# EAGLE design USB Door Controller (EAGLE 5.11)
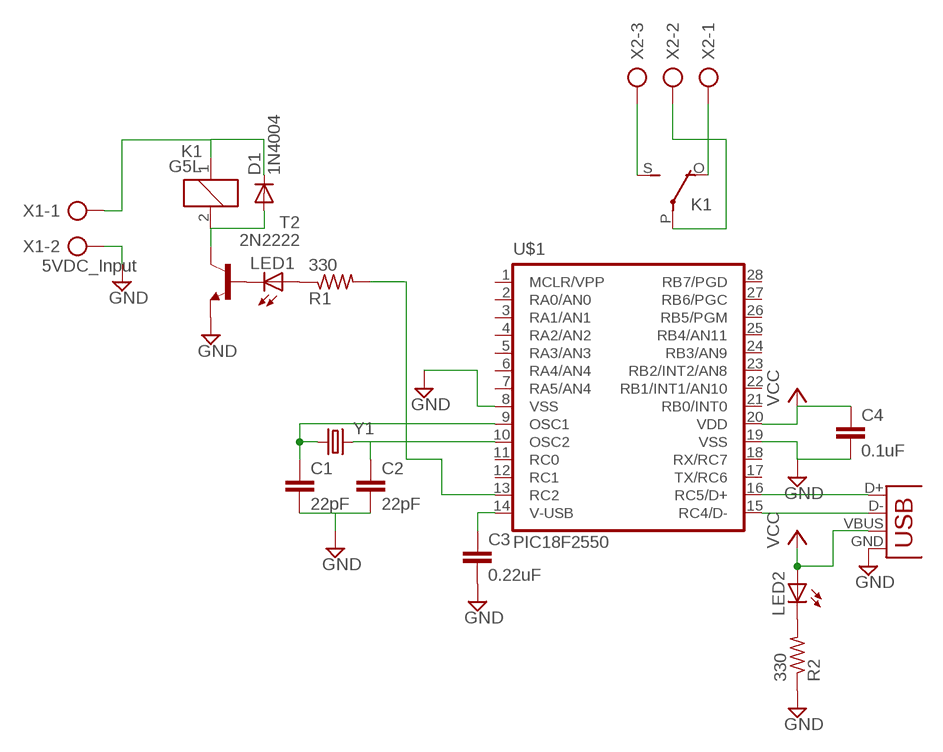
[diagram p0: schematic, sheet 1]

## Parts
C1  22pF  C5/3  [C5B3]
C2  22pF  C5/3  [C5B3]
C3  0.22uF  C5/3  [C5B3]
C4  0.1uF  C2,5-3  [C2.5-3]
D1  1N4004  [DO41-10]
K1  G5L  [G5LE]
LED1  LED3MM  [LED3MM]
LED2  LED3MM  [LED3MM]
R1  330  R-US_0204/7  [0204/7]
R2  330  R-US_0204/7  [0204/7]
T2  2N2222  [TO92-EBC-OVAL]
U$1  PIC18F2550  [DIL28-3]
X1  5VDC_Input  AK500/2-H  [AK500/2-H]
X2  AK500/3-H  [AK500/3-H]
X3  USBPTH  [USB-B-PTH]
Y1  CRYSTALHC49US  [HC49US]

## Nets
GND: C1.2 C2.2 C3.2 C4.2 R2.1 T2.E U$1.8(VSS) U$1.19(VSS) X1.2 X3.GND
N$1: D1.A K1.2 T2.C
N$2: LED1.K(C) T2.B
N$3: LED1.A R1.1
N$4: R1.2 U$1.13(RC2)
N$5: D1.C K1.1 X1.1
N$6: LED2.K(C) R2.2
N$7: C2.1 U$1.10(OSC2) Y1.2
N$8: C1.1 U$1.9(OSC1) Y1.1
N$11: C3.1 U$1.14(V-USB)
N$12: K1.O(2:O) X2.1
N$13: K1.S(2:S) X2.3
N$14: K1.P(2:P) X2.2
N$15: U$1.16(RC5/D+) X3.D+
N$16: U$1.15(RC4/D-) X3.D-
VCC: C4.1 LED2.A U$1.20(VDD) X3.VBUS
Unconnected: U$1.1(MCLR/VPP) U$1.2(RA0/AN0) U$1.3(RA1/AN1) U$1.4(RA2/AN2) U$1.5(RA3/AN3) U$1.6(RA4/AN4) U$1.7(RA5/AN4) U$1.11(RC0) U$1.12(RC1) U$1.17(TX/RC6) U$1.18(RX/RC7) U$1.21(RB0/INT0) U$1.22(RB1/INT1/AN10) U$1.23(RB2/INT2/AN8) U$1.24(RB3/AN9) U$1.25(RB4/AN11) U$1.26(RB5/PGM) U$1.27(RB6/PGC) U$1.28(RB7/PGD)

## Library data of the parts
C1-C4 = capacitor-wima:C: CAPACITOR naming: grid - package width
D1 = diode:1N4004: DIODE general purpose rectifier, 1 A
K1 = relay:G5L: RELAY 1 x switch, 10 A/120 V AC, 8 A/30 V ADC, Omron; OC_FARNELL: unknown; OC_NEWARK: unknown
LED1 LED2 = adafruit:LED: LED OSRAM: - CHIPLED LG R971, LG N971, LY N971, LG Q971, LY Q971, LO R971, LY R971 LH N974, LH R974 LS Q976, LO Q976, LY Q976 LO Q996 - Hyper CHIPLED LW Q18S LB Q993, LB Q99A, LB R99A - SideLED LS A670, LO A670, LY A670, LG A670, LP A670 LB A673, LV A673, LT A673, LW A673 LH A674 LY A675 LS A676, LA A676, LO A676, LY A676, LW A676 LS A679, LY A679, LG A679 - Hyper Micro SIDELED® LS Y876, LA Y876, LO Y876, LY Y876 LT Y87S - SmartLED LW L88C, LW L88S LB L89C, LB L89S, LG L890 LS L89K, LO L89K, LY L89K LS L896, LA L896, LO L896, LY L896 - TOPLED LS T670, LO T670, LY T670, LG T670, LP T670 LSG T670, LSP T670, LSY T670, LOP T670, LYG T670 LG T671, LOG T671, LSG T671 LB T673, LV T673, LT T673, LW T673 LH T674 LS T676, LA T676, LO T676, LY T676, LB T676, LH T676, LSB T676, LW T676 LB T67C, LV T67C, LT T67C, LS T67K, LO T67K, LY T67K, LW E67C LS E67B, LA E67B, LO E67B, LY E67B, LB E67C, LV E67C, LT E67C LW T67C LS T679, LY T679, LG T679 LS T770, LO T770, LY T770, LG T770, LP T770 LB T773, LV T773, LT T773, LW T773 LH T774 LS E675, LA E675, LY E675, LS T675 LS T776, LA T776, LO T776, LY T776, LB T776 LHGB T686 LT T68C, LB T68C - Hyper Mini TOPLED® LB M676 - Mini TOPLED Santana® LG M470 LS M47K, LO M47K, LY M47K Source: http://www.osram.convergy.de/
R1 R2 = adafruit:R-US_: RESISTOR, American symbol
T2 = adafruit:2N2222: NPN TRANSISTOR Big oval pads
U$1 = SparkFun:PIC18F2550
X1 = con-ptr500:AK500/2-H: CONNECTOR Aug. 2004 / PTR Meßtechnik: Die Bezeichnung der Serie AK505 wurde geändert. Es handelt sich hierbei um AK500 in horizontaler Ausführung.; OC_FARNELL: unknown; OC_NEWARK: unknown
X2 = con-ptr500:AK500/3-H: CONNECTOR Aug. 2004 / PTR Meßtechnik: Die Bezeichnung der Serie AK505 wurde geändert. Es handelt sich hierbei um AK500 in horizontaler Ausführung.; OC_FARNELL: unknown; OC_NEWARK: unknown
X3 = SparkFun:USB: USB Connectors USB-B-PTH is fully proven SKU : PRT-00139 USB-miniB is fully proven SKU : PRT-00587 USB-A-PCB is untested. USB-A-H is throughly reviewed, but untested. Spark Fun Electronics SKU : PRT-00437 USB-B-SMT is throughly reviewed, but untested. Needs silkscreen touching up. USB-A-S has not been used/tested USB-MB-H has not been used/tested
Y1 = SparkFun:CRYSTAL: Crystals Various standard crystals. Proven footprints. Spark Fun Electronics SKU : COM-00534

## Board
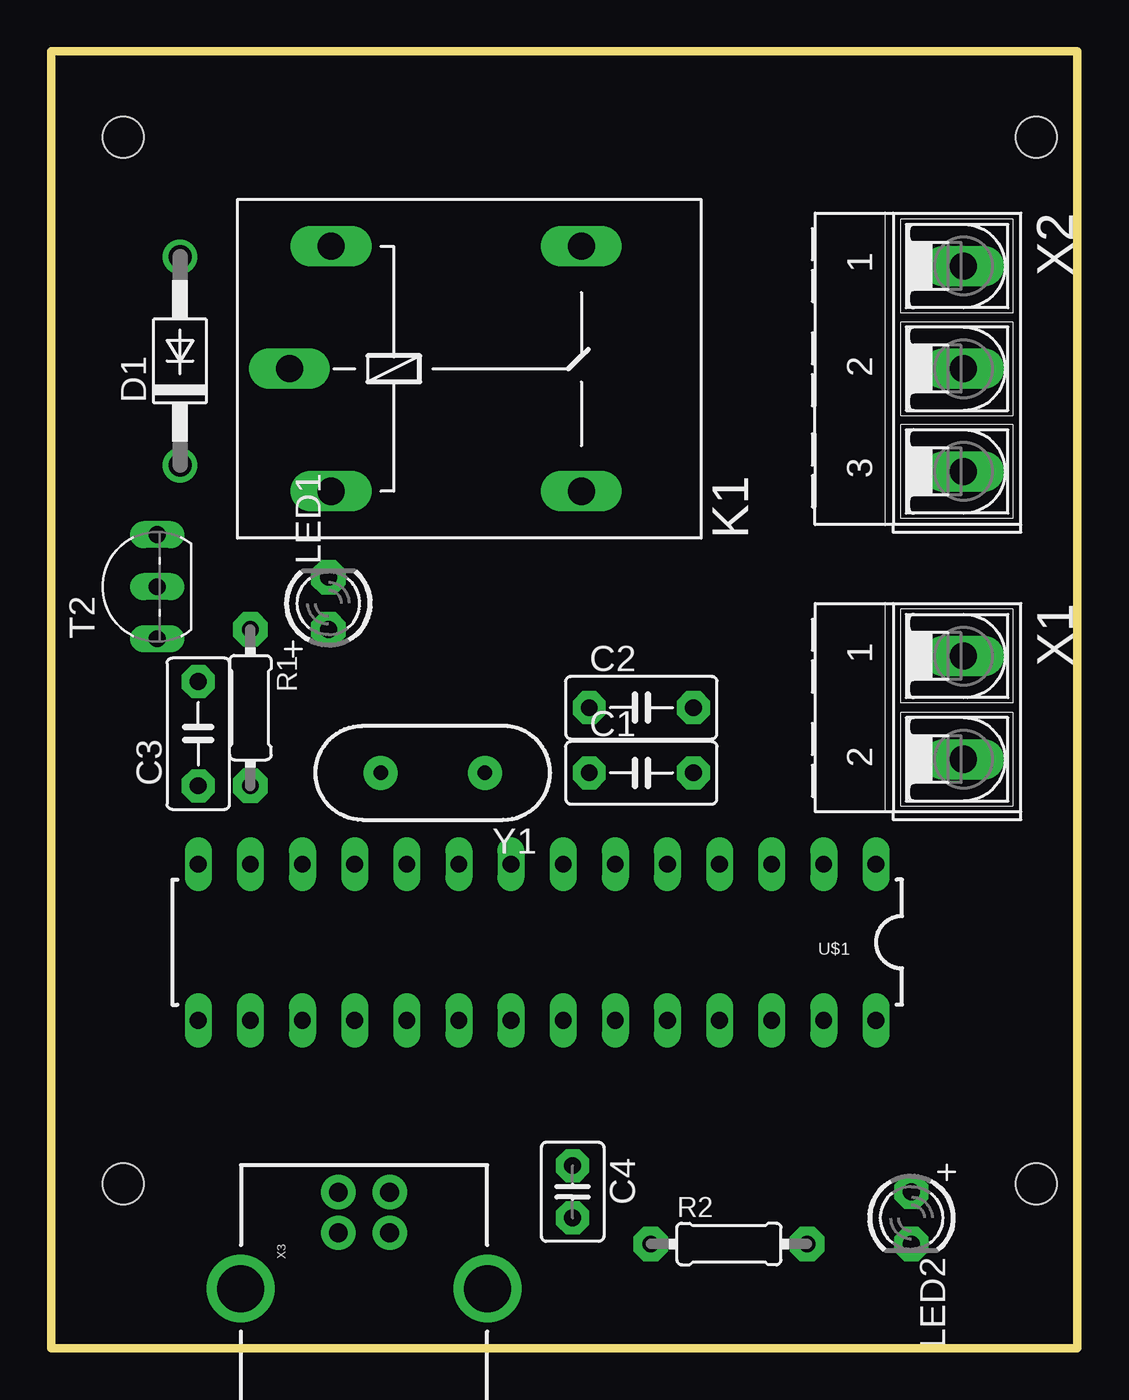
[diagram p1: board, top side]
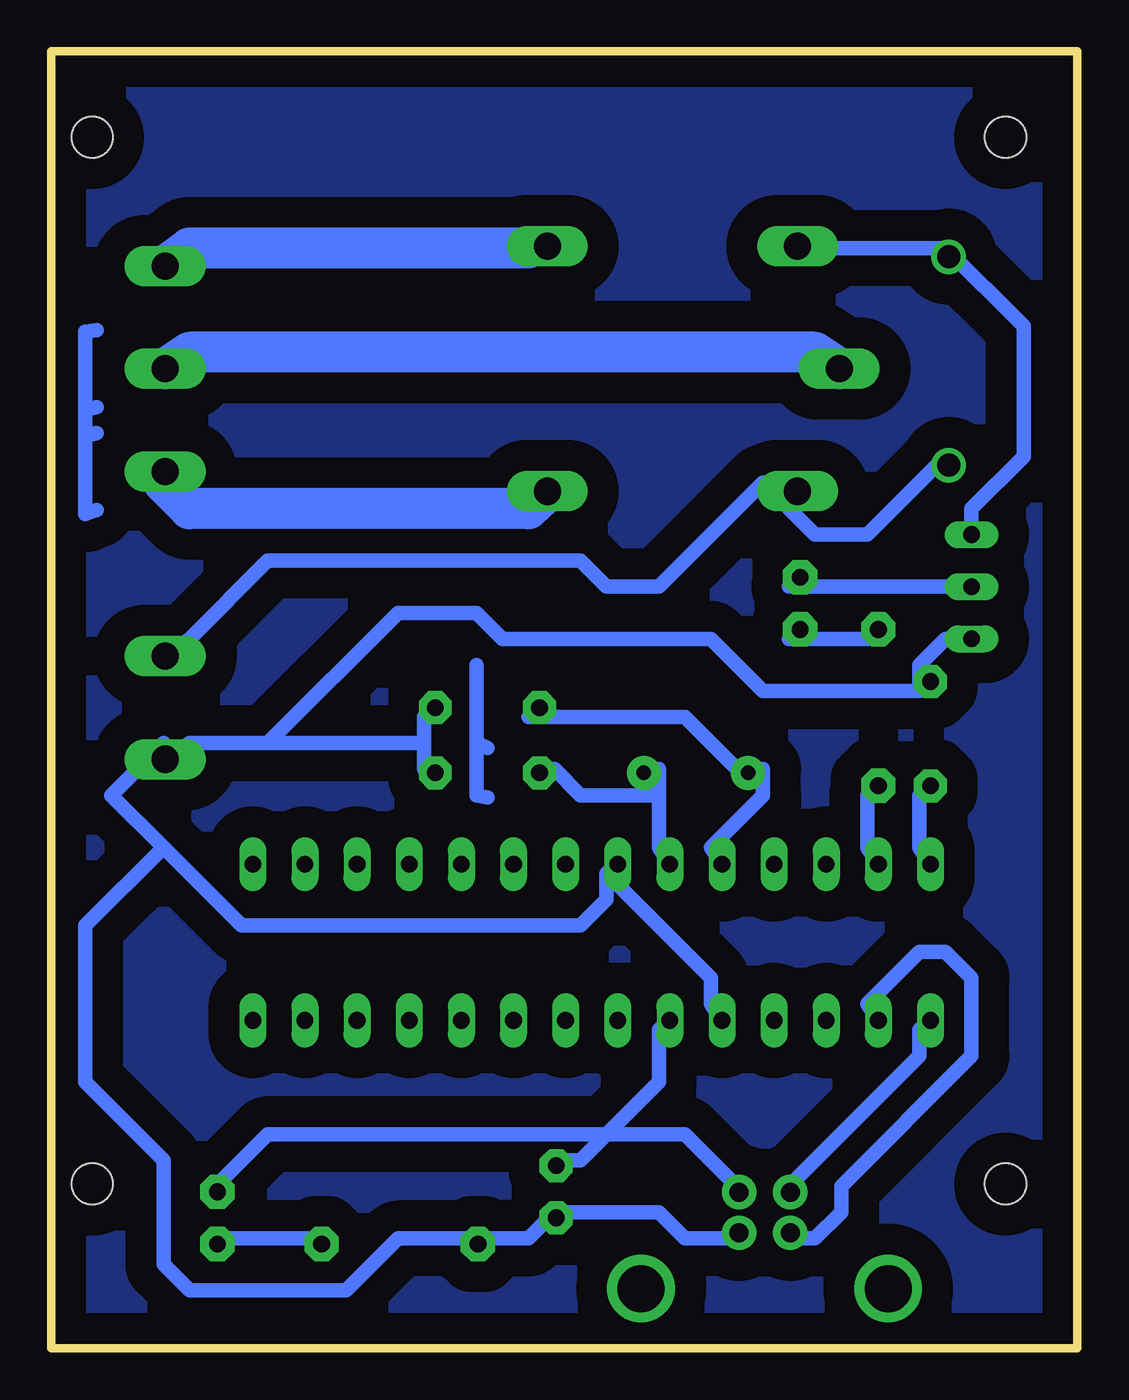
[diagram p2: board, bottom side, seen from below]

Size 50 x 63.19 mm. Coordinates in mm from the lower left corner, seen from the top.
Outline: 0,0 50,0 50,63.19 0,63.19 0,0
Copper layers (1*16): Top 0.035mm / dielectric 1.5mm / Bottom 0.035mm
Design rules "default *": minimum track width 0.7mm, minimum drill 0.6mm, track to track 0.7mm, track to pad 0.7mm, pad to pad 0.7mm, via to via 0.7mm, smd to smd 8mil, copper to edge 40mil, drill to drill 8mil, minimum pad ring 10mil, minimum via ring 8mil, stop-mask expansion 4mil, vias tented up to drill 0mil, thermal gap 10mil
Holes 2 mm at 3.5,8 48,8 48,59 3.5,59

### Footprints (pad centres in the part's own frame; a part is rotated, then mirrored left to right if it is on the bottom)
C5B3 = drill 0.813 pad 1.6 octagon: 1 -2.54,0; 2 2.54,0
C2.5-3 = drill 0.813 pad 1.6 octagon: 1 -1.27,0; 2 1.27,0
DO41-10 = drill 1.118 round: A 5.08,0; C -5.08,0
G5LE = drill 1.321 long: 1 -7.493,-5.969; 2 -7.493,5.969; O 4.699,5.969; P -9.525,0; S 4.699,-5.969
LED3MM = drill 0.813 pad 1.676 octagon: A -1.27,0; K 1.27,0
0204/7 = drill 0.813 pad 1.676 octagon: 1 -3.81,0; 2 3.81,0
TO92-EBC-OVAL = drill 0.813 long: B 0,-1.27; C 2.54,-1.27; E -2.54,-1.27
DIL28-3 = drill 0.813 long: 1 -16.51,-3.81; 2 -13.97,-3.81; 3 -11.43,-3.81; 4 -8.89,-3.81; 5 -6.35,-3.81; 6 -3.81,-3.81; 7 -1.27,-3.81; 8 1.27,-3.81; 9 3.81,-3.81; 10 6.35,-3.81; 11 8.89,-3.81; 12 11.43,-3.81; 13 13.97,-3.81; 14 16.51,-3.81; 15 16.51,3.81; 16 13.97,3.81; 17 11.43,3.81; 18 8.89,3.81; 19 6.35,3.81; 20 3.81,3.81; 21 1.27,3.81; 22 -1.27,3.81; 23 -3.81,3.81; 24 -6.35,3.81; 25 -8.89,3.81; 26 -11.43,3.81; 27 -13.97,3.81; 28 -16.51,3.81
AK500/2-H = drill 1.321 long: 1 -2.515,0; 2 2.515,0
AK500/3-H = drill 1.321 long: 1 -5.004,0; 2 0,0; 3 5.004,0
USB-B-PTH = drill 0.914 pad 1.676 round: D+ 0,1.25; D- 1.981,1.25; GND 0,-1.25; VBUS 1.981,-1.25 | drill 2.286 round: S1 -2.718,-6.02; S2 -2.718,6.02
HC49US = drill 0.7 pad 1.651 round: 1 -2.54,0; 2 2.54,0

### Placement (x,y rotation side)
C1  28.75,28.04 0 top
C2  28.75,31.21 0 top
C3  7.16,29.94 90 top
C4  25.4,7.62 270 top
D1  6.27,48.1 90 top
K1  21.13,47.72 0 top
LED1  13.51,36.29 90 top
LED2  41.91,6.35 270 top
R1  9.7,31.21 270 top
R2  33.02,5.08 0 top
T2  3.89,37.1 90 top
U$1  23.67,19.78 180 top
X1  44.45,31.21 270 top
X2  44.45,47.72 270 top
X3  15.24,5.62 90 top
Y1  18.59,28.04 180 top

### Tracks (layer width: path | path; a pad name or v marks a point on that pad's centre or on a via)
GND
  Bottom 0.7: 25.48,6.62 26.75,5.35 29.29,5.35 | 25.48,6.62 20.4,6.62 19.13,5.35 16.59,5.35 X3.GND | 25.48,6.62 C4.2 | 22.94,23.13 17.86,18.05 17.86,16.78 U$1.19 | 7.7,32.02 7.7,33.29 6.43,34.56 T2.E | 31.83,29.48 31.83,30.75 C2.2 | 31.83,29.48 31.83,28.21 C1.2 | 39.45,29.48 31.83,29.48 | 39.45,29.48 43.26,29.48 X1.2 44.53,29.48 47.07,26.94 44.53,24.4 | 7.7,32.02 15.32,32.02 17.86,34.56 28.02,34.56 29.29,35.83 33.1,35.83 39.45,29.48 | 7.7,32.02 C3.2 | 22.94,23.13 22.94,21.86 24.21,20.59 40.72,20.59 44.53,24.4 | 22.94,23.13 U$1.8 | 29.29,5.35 33.1,5.35 35.64,2.81 43.26,2.81 44.53,4.08 44.53,9.16 48.34,12.97 48.34,20.59 44.53,24.4 | 29.29,5.35 R2.1
N$1
  Bottom 0.7: T2.C 5.16,40.91 2.62,43.45 2.62,49.8 6.43,53.61 | 6.43,53.61 12.78,53.61 K1.2 | 6.43,53.61 D1.A
N$2
  Bottom 0.7: T2.B 14.05,37.1 LED1.K
N$3
  Bottom 0.7: R1.1 10.24,34.56 14.05,34.56 LED1.A
N$4
  Bottom 0.7: U$1.13 10.24,24.4 10.24,26.94 R1.2
N$5
  Bottom 0.7: D1.C 6.43,43.45 10.24,39.64 12.78,39.64 14.05,40.91 K1.1 14.05,42.18 15.32,42.18 20.4,37.1 22.94,37.1 24.21,38.37 39.45,38.37 43.26,34.56 X1.1
N$6
  Bottom 0.7: R2.2 36.91,5.35 41.99,5.35 LED2.K
N$7
  Bottom 0.7: U$1.10 17.86,24.4 15.32,26.94 15.32,28.21 Y1.2 16.59,28.21 19.13,30.75 26.75,30.75 C2.1
N$8
  Bottom 0.7: 20.4,26.94 20.4,28.21 Y1.1 | 20.4,26.94 20.4,24.4 U$1.9 | 20.4,26.94 24.21,26.94 25.48,28.21 C1.1
N$9
  Bottom 0.7: 29.29,29.48 29.29,33.29 | 29.29,29.48 29.29,26.94 28.75,26.83 | 29.29,29.48 28.75,29.24
N$10
  Bottom 0.7: 48.34,44.45 48.34,40.64 47.8,40.84 | 48.34,44.45 47.8,44.59 | 48.34,45.72 48.34,45.99 | 48.34,45.99 48.34,49.53 47.8,49.59 | 48.28,45.73 47.8,45.85 | 48.34,45.72 48.28,45.73 | 48.34,45.99 48.28,45.73 | 48.34,44.45 48.34,45.72
N$11
  Bottom 0.7: U$1.14 7.7,24.4 7.7,26.94 C3.1
N$12
  Bottom 0.7: K1.O 26.75,53.61
  Bottom 2: 26.75,53.61 43.26,53.61 X2.1
N$13
  Bottom 0.7: 44.53,42.18 X2.3
  Bottom 2: 44.53,42.18 43.26,40.91 26.75,40.91 K1.S
N$14
  Bottom 2: K1.P 12.78,48.53 43.26,48.53 X2.2
N$15
  Bottom 0.7: U$1.16 10.24,16.78 7.7,19.32 6.43,19.32 5.16,18.05 5.16,14.24 11.51,7.89 11.51,6.62 12.78,5.35 14.05,5.35 X3.D+
N$16
  Bottom 0.7: U$1.15 7.7,15.51 7.7,14.24 14.05,7.89 X3.D-
N$17
  pour Bottom (isolate 1.5): 1,62 49,62 49,1 1,1
VCC
  Bottom 0.7: 22.94,10.43 24.21,9.16 25.48,9.16 C4.1 | 22.94,10.43 20.4,12.97 20.4,15.51 U$1.20 | 22.94,10.43 19.13,10.43 16.59,7.89 X3.VBUS | 22.94,10.43 39.45,10.43 41.99,7.89 LED2.A